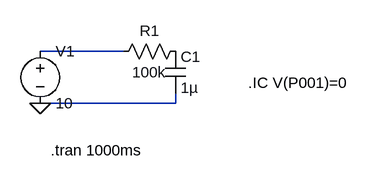
[diagram p0: schematic Carica RC.asc]
Carica RC.asc, the LTspice schematic file:
Version 4
SHEET 1 880 680
WIRE 320 240 192 240
WIRE 400 320 400 304
WIRE 400 320 192 320
FLAG 192 320 0
SYMBOL res 416 224 R90
WINDOW 0 0 56 VBottom 2
WINDOW 3 32 56 VTop 2
SYMATTR InstName R1
SYMATTR Value 100k
SYMBOL cap 384 240 R0
SYMATTR InstName C1
SYMATTR Value 1µ
SYMBOL voltage 192 224 R0
SYMATTR InstName V1
SYMATTR Value 10
TEXT 208 392 Left 2 !.tran 1000ms
TEXT 512 288 Left 2 !.IC V(P001)=0

The netlist it stands for:
* Carica RC.asc
R1 P001 N001 100k
C1 P001 0 1µ
V1 N001 0 10
.tran 1000ms
.IC V(P001)=0
.backanno
.end